# Altium project ControlBoard.PrjPcb
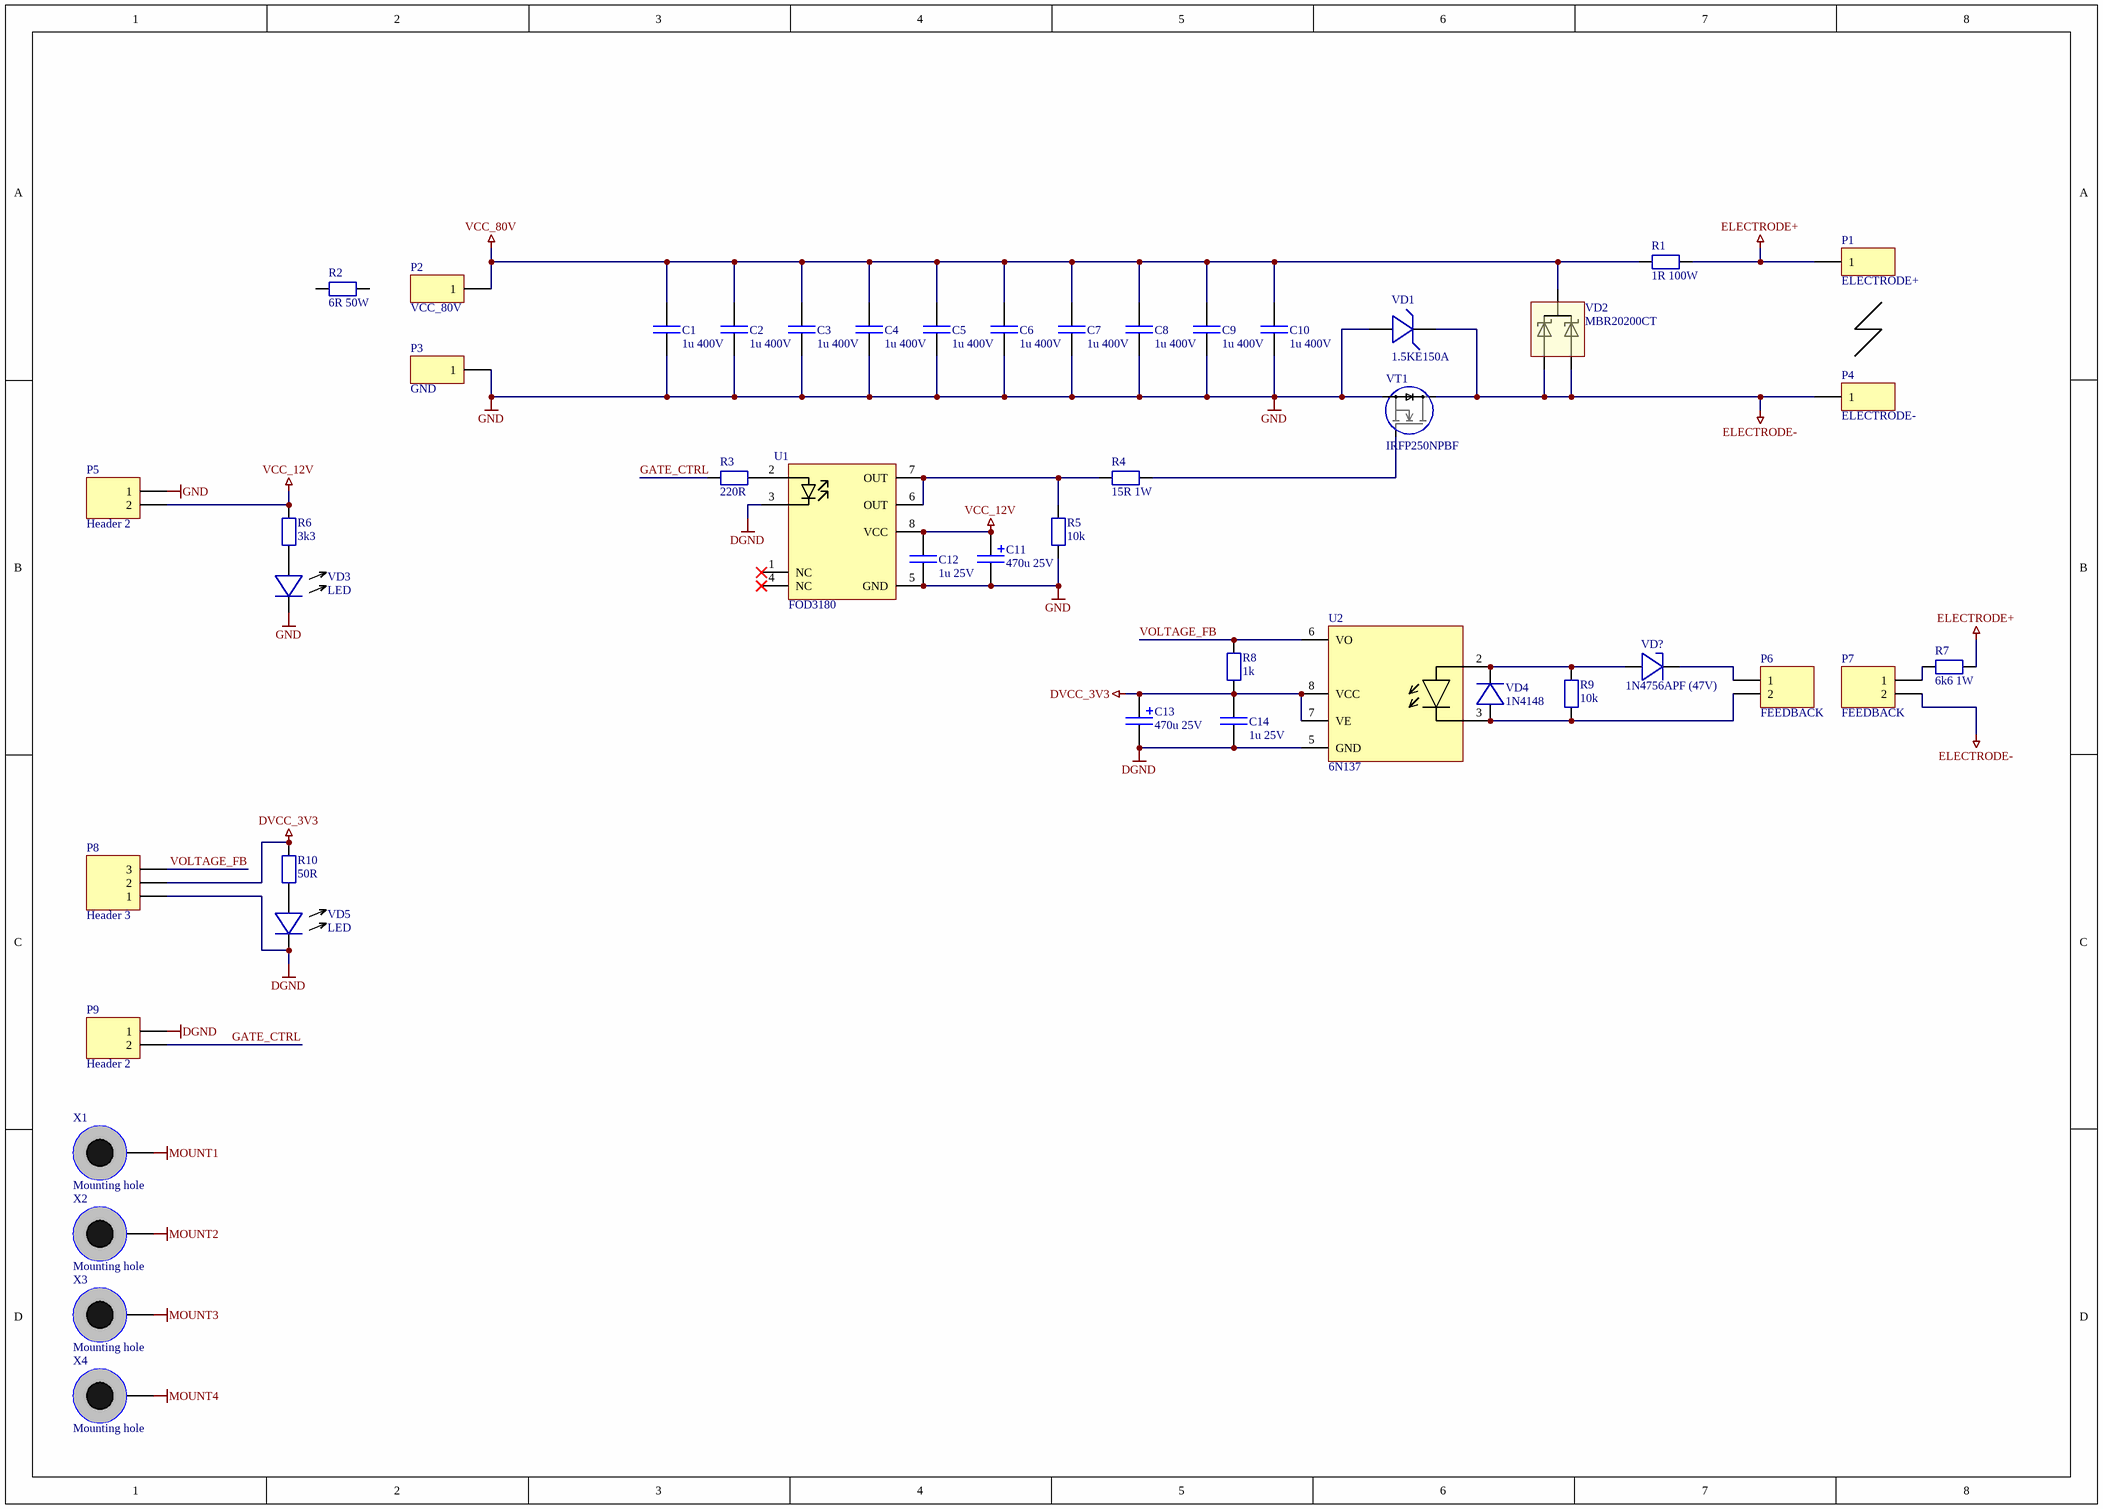
[diagram p0: Main.SchDoc]
1 sheet, 46 parts. Net scope: global (net labels, ports and power ports of the same name join across sheets).
Board file: PCB.PcbDoc

## Sheet Main.SchDoc
size A3

### Parts
C1  1u 400V  [К73-17]
C2  1u 400V  [К73-17]
C3  1u 400V  [К73-17]
C4  1u 400V  [К73-17]
C5  1u 400V  [К73-17]
C6  1u 400V  [К73-17]
C7  1u 400V  [К73-17]
C8  1u 400V  [К73-17]
C9  1u 400V  [К73-17]
C10  1u 400V  [К73-17]
C11  470u 25V  [TECAP_TYPE_C]
C12  1u 25V  [C_0805/2012]
C13  470u 25V  [TECAP_TYPE_A]
C14  1u 25V  [C_0603/1608]
P1  ELECTRODE+  [WIRE_SMD_10X10]
P2  VCC_80V  [WIRE_SMD_10X10]
P3  GND  [WIRE_SMD_10X10]
P4  ELECTRODE-  [WIRE_SMD_10X10]
P5  Header 2  [CWF-2]
P6  FEEDBACK  [CWF-2]
P7  FEEDBACK  [CWF-2]
P8  Header 3  [CWF-3]
P9  Header 2  [CWF-2]
R1  1R 100W  [R_50W]
R2  6R 50W  [R_50W]
R3  220R  [R_0603/1608]
R4  15R 1W  [AXIAL-0.25W]
R5  10k  [R_0603/1608]
R6  3k3  [R_0603/1608]
R7  6k6 1W  [AXIAL-0.4]
R8  1k  [R_0603/1608]
R9  10k  [R_0603/1608]
R10  50R  [R_0603/1608]
U1  FOD3180  [PDIP-8]
U2  6N137  [PDIP-8]
VD1  1.5KE150A  [DO-27 / DO-201]
VD2  MBR20200CT  [TO-220 HOR]
VD3  LED  [LED_0603/1608]
VD4  1N4148  [DO214AA/SMB]
VD5  LED  [LED_0603/1608]
VD?  1N4756APF (47V)  [DO-35]
VT1  IRFP250NPBF  [TO-247_HOR]
X1  Mounting hole  [HOLE_M2_D4.0/2.5]  (no BOM)
X2  Mounting hole  [HOLE_M2_D4.0/2.5]  (no BOM)
X3  Mounting hole  [HOLE_M2_D4.0/2.5]  (no BOM)
X4  Mounting hole  [HOLE_M2_D4.0/2.5]  (no BOM)

### Nets
DGND: C13.2(NEG) C14.2 P8.1 P9.1 U1.3 U2.5(GND) VD5.C
DVCC_3V3: C13.1(POS) C14.1 P8.2 R8.1 R10.2 U2.7(VE) U2.8(VCC)
ELECTRODE+: P1.1 R1.1 R7.2
ELECTRODE-: P4.1 P7.2 VD1.2 VD2.1 VD2.3 VT1.D
GND: C1.2 C2.2 C3.2 C4.2 C5.2 C6.2 C7.2 C8.2 C9.2 C10.2 C11.2(NEG) C12.2 P3.1 P5.1 R5.1 U1.5(GND) VD1.1 VD3.C VT1.S
MOUNT1: X1.1
MOUNT2: X2.1
MOUNT3: X3.1
MOUNT4: X4.1
VCC_12V: C11.1(POS) C12.1 P5.2 R6.2 U1.8(VCC)
VCC_80V: C1.1 C2.1 C3.1 C4.1 C5.1 C6.1 C7.1 C8.1 C9.1 C10.1 P2.1 R1.2 VD2.2
GATE_CTRL: P9.2 R3.1
VOLTAGE_FB: P8.3 R8.2 U2.6(VO)
NetP6_1: P6.1 VD?.2
NetP6_2: P6.2 R9.1 U2.3 VD4.1
NetP7_1: P7.1 R7.1
NetR3_2: R3.2 U1.2
NetR4_1: R4.1 R5.2 U1.6(OUT) U1.7(OUT)
NetR4_2: R4.2 VT1.G
NetR6_1: R6.1 VD3.A
NetR9_2: R9.2 U2.2 VD4.2 VD?.1
NetR10_1: R10.1 VD5.A

Not connected (* = marked no-connect by the designer): R2 1 2; U1 1(NC)* 4(NC)*

### Library data of the parts
C1-C10 C12 C14 = Capacitor: Non-polarized capacitor
C11 C13 = Capacitor polar: Polarized capacitor
P1-P4 = Header 1: Header, 1-Pin; LatestRevisionDate: 17-Jul-2002; LatestRevisionNote: Re-released for DXP Platform.; Publisher: Altium Limited
P5-P7 P9 = Header 2: Header, 2-Pin; LatestRevisionDate: 17-Jul-2002; LatestRevisionNote: Re-released for DXP Platform.; Publisher: Altium Limited
P8 = Header 3: Header, 3-Pin; LatestRevisionDate: 17-Jul-2002; LatestRevisionNote: Re-released for DXP Platform.; Publisher: Altium Limited
R1-R10 = Resistor
U1 = FOD3180: MOSFET driver
VD1 = TVS
VD2 = Schottky x2 C-COM
VD4 = Diode
VD? = Zener: Schottky diode
VT1 = MOSFET N

## Assembly variants
Base: all parts fitted